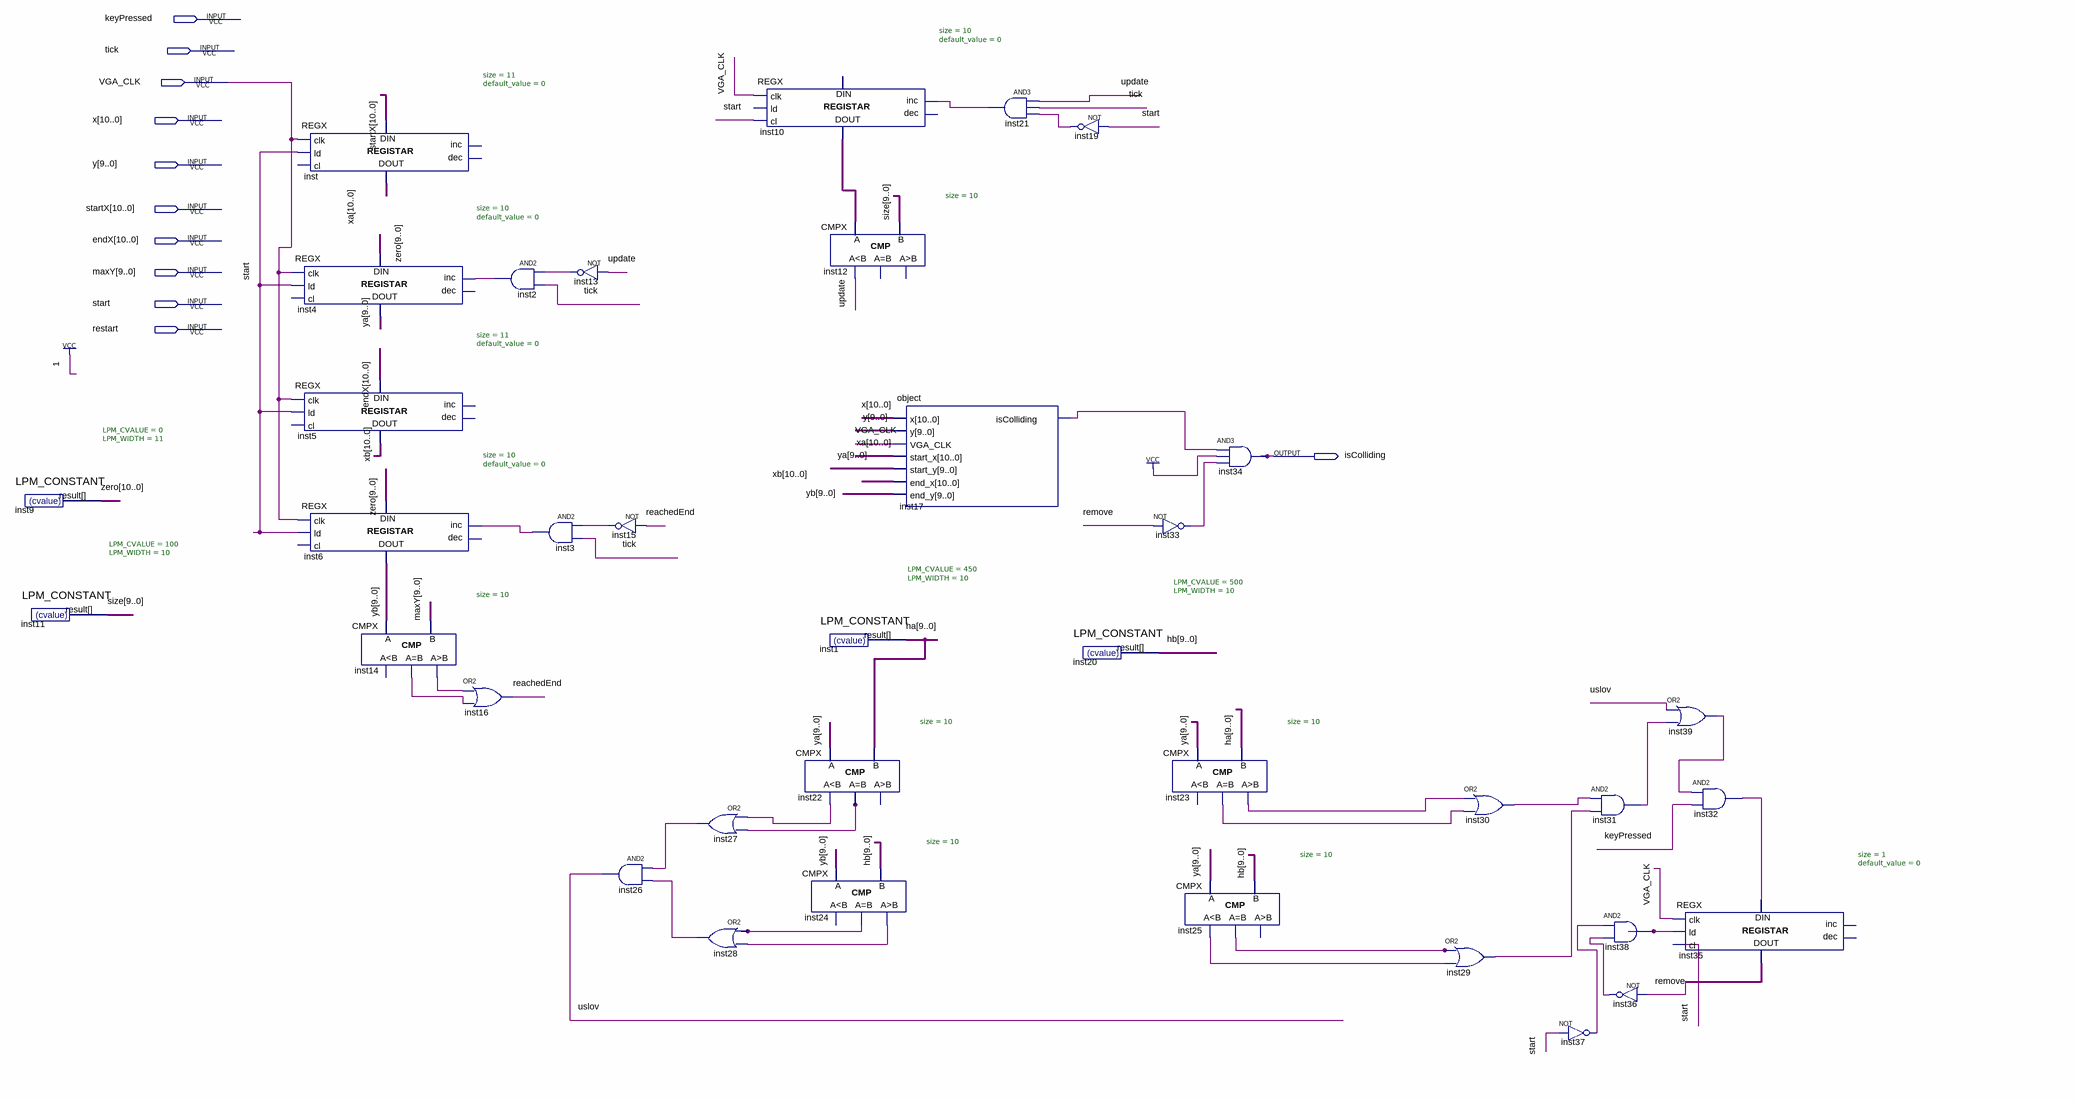
[diagram p0: schematic sheet]
// Quartus schematic tile.bdf as structural Verilog: 37 symbols, 11 pins
module tile (
  input  keyPressed,
  input  tick,
  input  VGA_CLK,
  input  [10:0] x,
  input  [9:0] y,
  input  [10:0] startX,
  input  [10:0] endX,
  input  [9:0] maxY,
  input  start,
  input  restart,
  output isColliding
);

  wire inst2_out, inst3_out, inst13_out, inst14_eq, inst14_gr, inst15_out, inst17_iscolliding, inst19_out,
       inst21_out, inst22_eq, inst22_ls, inst23_eq, inst23_gr, inst24_eq, inst24_gr, inst25_eq, inst25_ls,
       inst27_out, inst28_out, inst29_out, inst30_out, inst31_out, inst32_out, inst33_out, inst35_data_out,
       inst36_out, inst37_out, inst38_out, inst39_out, reachedEnd, remove, update, uslov;
  wire [9:0] ha, hb, inst10_data_out, size, ya, yb;
  wire [10:0] xa, xb, zero;

  LPM_CONSTANT #(.LPM_CVALUE(0), .LPM_WIDTH(11)) inst9 (.result(zero));
  LPM_CONSTANT #(.LPM_CVALUE(100), .LPM_WIDTH(10)) inst11 (.result(size));
  REGX #(.size(11), .default_value(0)) inst (
    .clk(VGA_CLK), .ld(start), .data_in(startX), .data_out(xa));  // open: cl, inc, dec
  REGX #(.size(10), .default_value(0)) inst4 (
    .clk(VGA_CLK), .ld(start), .inc(inst2_out), .data_in(zero[9:0]), .data_out(ya));  // open: cl, dec
  REGX #(.size(11), .default_value(0)) inst5 (
    .clk(VGA_CLK), .ld(start), .data_in(endX), .data_out(xb));  // open: cl, inc, dec
  REGX #(.size(10), .default_value(0)) inst6 (
    .clk(VGA_CLK), .ld(start), .inc(inst3_out), .data_in(zero[9:0]), .data_out(yb));  // open: cl, dec
  CMPX #(.size(10)) inst14 (.A(yb), .B(maxY), .eq(inst14_eq), .gr(inst14_gr));  // open: ls
  or inst16 (reachedEnd, inst14_gr, inst14_eq);
  and inst2 (inst2_out, inst13_out, tick);
  not inst13 (inst13_out, update);
  and inst3 (inst3_out, inst15_out, tick);
  not inst15 (inst15_out, reachedEnd);
  and inst26 (uslov, inst27_out, inst28_out);
  or inst27 (inst27_out, inst22_ls, inst22_eq);
  or inst28 (inst28_out, inst24_eq, inst24_gr);
  REGX #(.size(10), .default_value(0)) inst10 (
    .clk(VGA_CLK), .cl(start), .inc(inst21_out), .data_out(inst10_data_out));  // open: ld, dec, data_in
  CMPX #(.size(10)) inst12 (.A(inst10_data_out), .B(size), .ls(update));  // open: eq, gr
  LPM_CONSTANT #(.LPM_CVALUE(450), .LPM_WIDTH(10)) inst1 (.result(ha));
  CMPX #(.size(10)) inst22 (.A(ya), .B(ha), .ls(inst22_ls), .eq(inst22_eq));  // open: gr
  CMPX #(.size(10)) inst24 (.A(yb), .B(hb), .eq(inst24_eq), .gr(inst24_gr));  // open: ls
  object inst17 (
    .x(x), .y(y), .VGA_CLK(VGA_CLK), .start_x(xa), .start_y(ya), .end_x(xb), .end_y(yb),
    .isColliding(inst17_iscolliding));
  and inst21 (inst21_out, update, tick, inst19_out);
  not inst19 (inst19_out, start);
  LPM_CONSTANT #(.LPM_CVALUE(500), .LPM_WIDTH(10)) inst20 (.result(hb));
  not inst33 (inst33_out, remove);
  CMPX #(.size(10)) inst23 (.A(ya), .B(ha), .eq(inst23_eq), .gr(inst23_gr));  // open: ls
  CMPX #(.size(10)) inst25 (.A(ya), .B(hb), .ls(inst25_ls), .eq(inst25_eq));  // open: gr
  and inst34 (isColliding, inst17_iscolliding, 1'b1, inst33_out);
  or inst30 (inst30_out, inst23_gr, inst23_eq);
  or inst29 (inst29_out, inst25_eq, inst25_ls);
  and inst31 (inst31_out, inst30_out, inst29_out);
  not inst37 (inst37_out, start);
  and inst38 (inst38_out, inst37_out, inst36_out);
  not inst36 (inst36_out, remove);
  or inst39 (inst39_out, uslov, inst31_out);
  and inst32 (inst32_out, inst39_out, keyPressed);
  REGX #(.size(1), .default_value(0)) inst35 (
    .clk(VGA_CLK), .ld(inst38_out), .cl(start), .data_in(inst32_out), .data_out(inst35_data_out));  // open: inc, dec
endmodule
